# Altium schematic sheet PCB四轴.SchDoc: Fly_Control
size A4; CompanyName: BUPT; DrawnBy: BUPT_HCM; Organization: BUPT_Robot; Revision: A; SheetNumber: 1; SheetTotal: 2; Version: 1.0; LibVersion: 1.0
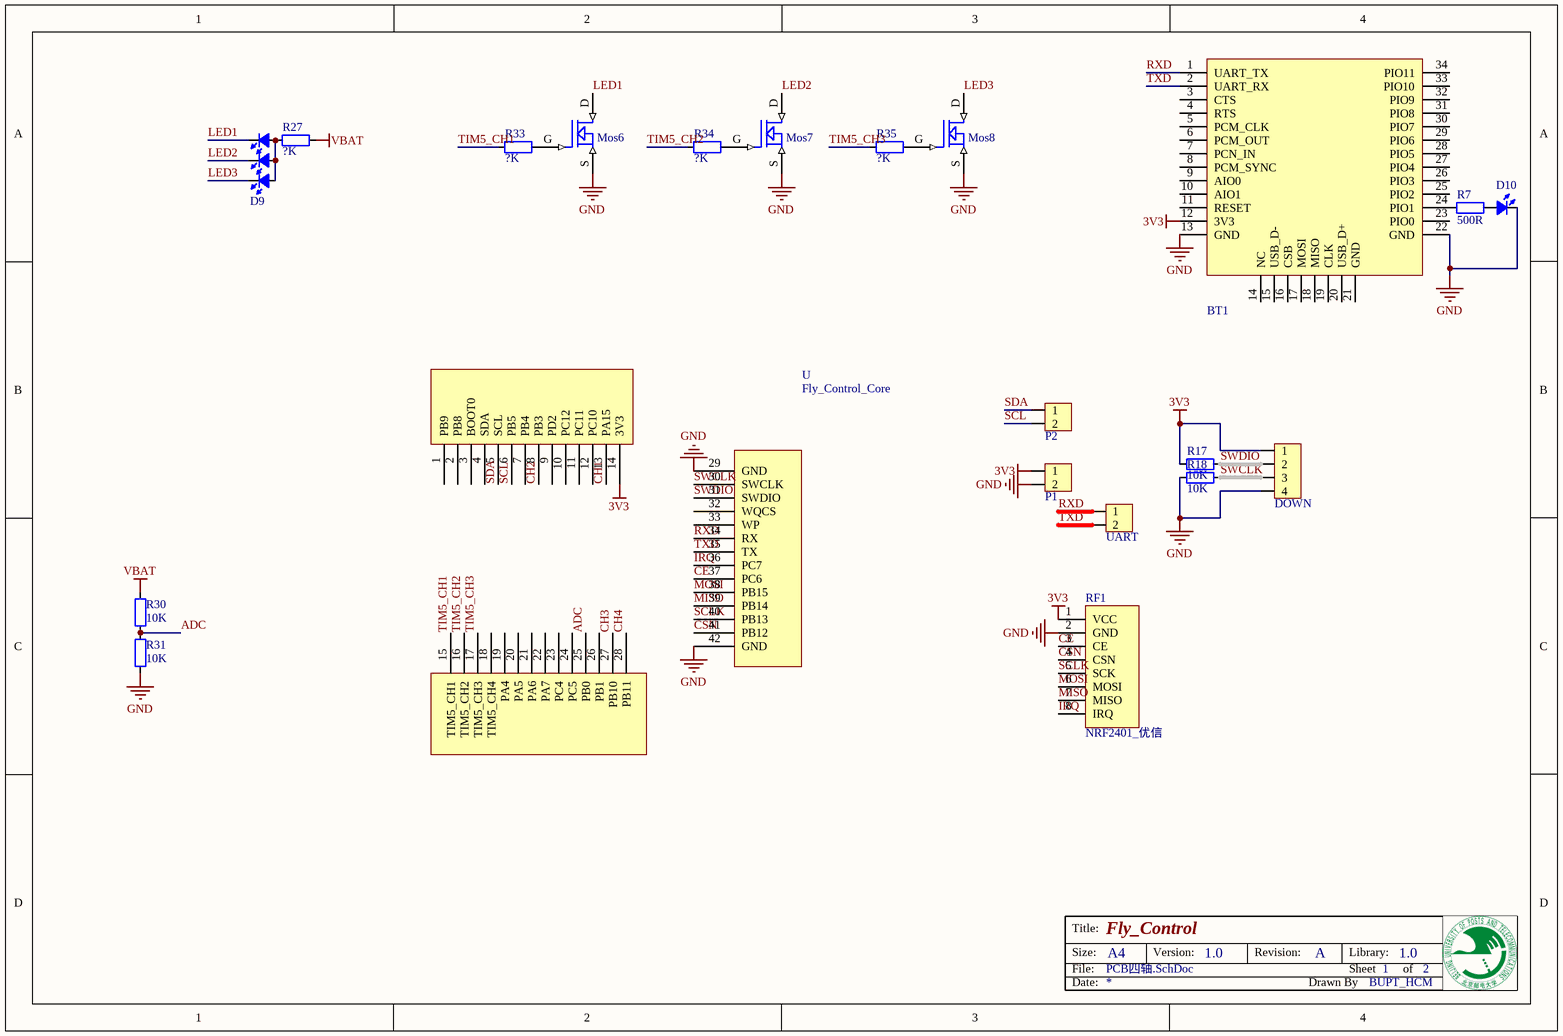
[diagram p0: PCB四轴.SchDoc]

## Parts
BT1  Bluetooth_HC05  [Bluetooth_HC05]  (value not drawn)
D9  LED_5050_RGB  [LED_5050_6P]  (value not drawn)
D10  LED_0805  [LED_0805_BLUE]  (value not drawn)
DOWN  HDR1x4_2.54  [HDR1X4_2.54_90]  (value not drawn)
Mos6  MOSFET N  [Nmos_SOT23]  (value not drawn)
Mos7  MOSFET N  [Nmos_SOT23]  (value not drawn)
Mos8  MOSFET N  [Nmos_SOT23]  (value not drawn)
P1  HDR1x2_2.54  [HDR1X2_2.54_180]  (value not drawn)
P2  HDR1x2_2.54  [HDR1X2_2.54_180]  (value not drawn)
R7  value 500R  [RES_0603]  (hidden comment: Res_0603)
R17  value 10K  [RES_0603]  (hidden comment: Res_0603)
R18  value 10K  [RES_0603]  (hidden comment: Res_0603)
R27  value ?K  [RES_0603]  (hidden comment: Res_0603)
R30  value 10K  [RES_0603]  (hidden comment: Res_0603)
R31  value 10K  [RES_0603]  (hidden comment: Res_0603)
R33  value ?K  [RES_0603]  (hidden comment: Res_0603)
R34  value ?K  [RES_0603]  (hidden comment: Res_0603)
R35  value ?K  [RES_0603]  (hidden comment: Res_0603)
RF1  NRF2401_优信  [nrf24l01_youxin]
U  Fly_Control_Core  [Fly_Control_Core]
UART  HDR1x2_2.54  [HDR1X2_2.54_180]  (value not drawn)

## Nets
3V3: BT1.12(3V3) DOWN.1 P1.1 R17.2 RF1.1(VCC) U.14(3V3)
GND: BT1.13(GND) BT1.22(GND) D10.2(K) DOWN.4 Mos6.S Mos7.S Mos8.S P1.2 R18.2 R31.1 RF1.2(GND) U.29(GND) U.42(GND)
VBAT: R27.1 R30.2
ADC: R30.1 R31.2 U.25(PB0)
CE: RF1.3(CE) U.37(PC6)
CH1: U.13(PA15)
CH2: U.8(PB3)
CH3: U.27(PB10)
CH4: U.28(PB11)
CSN: RF1.4(CSN) U.41(PB12)
IRQ: RF1.8(IRQ) U.36(PC7)
LED1: D9.3(K) Mos6.D
LED2: D9.2(K) Mos7.D
LED3: D9.1(K) Mos8.D
MISO: RF1.7(MISO) U.39(PB14)
MOSI: RF1.6(MOSI) U.38(PB15)
RXD: BT1.1(UART_TX) U.34(RX) UART.1
SCL: P2.2 U.6(PB5)
SCLK: RF1.5(SCK) U.40(PB13)
SDA: P2.1 U.5(SCL)
SWCLK: DOWN.3 R18.1 U.30(SWCLK)
SWDIO: DOWN.2 R17.1 U.31(SWDIO)
TIM5_CH1: R33.1 U.15(TIM5_CH1)
TIM5_CH2: R34.1 U.16(TIM5_CH2)
TIM5_CH3: R35.1 U.17(TIM5_CH3)
TXD: BT1.2(UART_RX) U.35(TX) UART.2
NetBT1_24: BT1.24(PIO1) R7.1
NetD9_4: D9.4(A) D9.5(A) D9.6(A) R27.2
NetD10_1: D10.1(A) R7.2
NetMos6_G: Mos6.G R33.2
NetMos7_G: Mos7.G R34.2
NetMos8_G: Mos8.G R35.2

Not connected (* = marked no-connect by the designer): BT1 3(CTS) 4(RTS) 5(PCM_CLK) 6(PCM_OUT) 7(PCN_IN) 8(PCM_SYNC) 9(AIO0) 10(AIO1) 11(RESET) 14(NC) 15(USB_D-) 16(CSB) 17(MOSI) 18(MISO) 19(CLK) 20(USB_D+) 21(GND) 23(PIO0) 25(PIO2) 26(PIO3) 27(PIO4) 28(PIO5) 29(PIO6) 30(PIO7) 31(PIO8) 32(PIO9) 33(PIO10) 34(PIO11); U 1(PB9) 2(PB8) 3(BOOT0) 4(SDA) 7(PB4) 9(PD2) 10(PC12) 11(PC11) 12(PC10) 18(TIM5_CH4) 19(PA4) 20(PA5) 21(PA6) 22(PA7) 23(PC4) 24(PC5) 26(PB1) 32(WQCS) 33(WP)

## Notes on the sheet
- Title:
- Size:
- Date:
- File:
- A4
- Version:
- Revision:
- Drawn By
- Sheet
- Library:
- of

## Library data of the parts
BT1 = Bluetooth_HC05: Module
D9 = LED_5050_RGB: LED
D10 = LED_0805: LED
DOWN = HDR1x4_2.54: Header
Mos6-Mos8 = MOSFET N: MOS SOT23
P1 P2 UART = HDR1x2_2.54: Header
R7 R17 R18 R27 R30 R31 R33-R35 = Res_0603: Resistor